# Altium schematic sheet Netconn.SchDoc
size 420 x 297 mm; Scale: 1:1; DocumentType: Схема электрическая принципиальная; FirstReferrence: АБВГ.123456.001
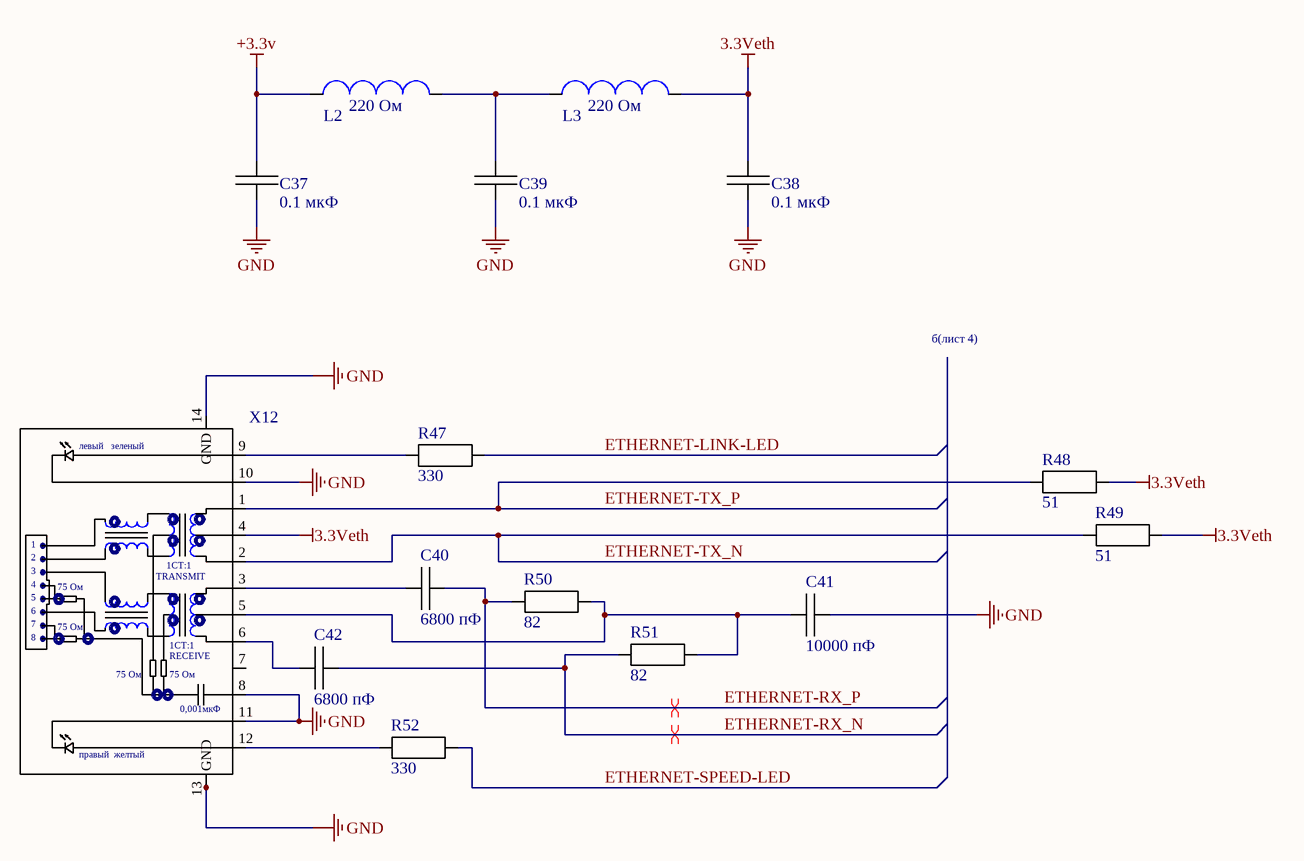
[diagram p0: Netconn.SchDoc]

## Parts
C37  0.1 мкФ  [К10-2,0х1,25х1,0]
C38  0.1 мкФ  [К10-2,0х1,25х1,0]
C39  0.1 мкФ  [К10-2,0х1,25х1,0]
C40  6800 пФ  [К10-2,0х1,25х1,0]
C41  10000 пФ  [К10-2,0х1,25х1,0]
C42  6800 пФ  [К10-2,0х1,25х1,0]
L2  220 Ом  [BLM21P_0805]
L3  220 Ом  [BLM21P_0805]
R47  330  [Р1-12-0,125]
R48  51  [Р1-12-0,125]
R49  51  [Р1-12-0,125]
R50  82  [Р1-12-0,125]
R51  82  [Р1-12-0,125]
R52  330  [Р1-12-0,125]
X12  (no value)  [HR911105]

## Nets
3.3Veth: C38.2 L3.2 R48.2 R49.2 X12.4
+3.3v: C37.2 L2.1
GND: C37.1 C38.1 C39.1 C41.2 X12.8 X12.10 X12.11 X12.13(GND) X12.14(GND)
ETHERNET-LINK-LED: R47.1
ETHERNET-RX_N: C42.2 R51.1
ETHERNET-RX_P: C40.2 R50.1
ETHERNET-SPEED-LED: R52.1
ETHERNET-TX_N: R49.1 X12.2
ETHERNET-TX_P: R48.1 X12.1
NetC39_2: C39.2 L2.2 L3.1
NetC40_1: C40.1 X12.3
NetC41_1: C41.1 R50.2 R51.2 X12.5
NetC42_1: C42.1 X12.6
NetR47_2: R47.2 X12.9
NetR52_2: R52.2 X12.12

Not connected (* = marked no-connect by the designer): X12 7

## Layout directives
differential pair: ETHERNET-RX_N, ETHERNET-RX_P

## Notes on the sheet
- б(лист 4)
- Перв. примен.
- Справ. №
- Подп. и дата
- Инв. № дубл.
- Взам. инв. №
- Разраб.
- Изм.
- Лист
- № докум.
- Подп.
- Дата
- Лит.
- Масса
- Масштаб
- Пров.
- Т.контр.
- Листов
- Инв. № подл.
- Утв.
- Н.контр.
- 2.106-A3
- Копировал
- Формат А3
- (in symbol HR911105A) левый   зеленый; 1СТ:1; TRANSMIT; 75 Ом; RECEIVE; 0,001мкФ; правый  желтый

## Library data of the parts
C37-C39 = 0805-X5R-2,2мкФ-10В-10%: Manufacturer: AVX; ManufacturerPartNumber: 0805ZD225KAT2A; TKE: X5R; Power/Voltage: 10 В; Tolerance: ±10%; Value: 2.2 мкФ; Category: Конденсатор; PartNumber: 0805ZD225KAT2A
C40-C42 = 0805-X5R-2,2мкФ-10В-10%: Manufacturer: AVX; ManufacturerPartNumber: 0805ZD225KAT2A; TKE: X5R; Power/Voltage: 10 В; Tolerance: ±10%; Category: Конденсатор; PartNumber: 0805ZD225KAT2A
  C40 C42: Value: 6800 пФ
  C41: Value: 10000 пФ
L2 L3 = BLM21PG221SH1: Manufacturer: Murata; PartNumber1: (220 Ом ±25% 2000мА); Power/Voltage: 2000мА; Tolerance: ±25%; Category: Катушка индуктивности; ManufacturerPartNumber: BLM21PG221SH1; Value: 220 Ом
R47-R52 = Р1-12-0,125-10,0 кОм±1%: PartNumber: АЛЯР.434110.005 ТУ; ManufacturerPartNumber: Р1-12-0,125-10,0 кОм±1%-Л; Tolerance: ±1%-Л; Power/Voltage: 0,125; Value: 10,0 кОм; Category: Резистор
X12 = HR911105A: Manufacturer: Pulse Electronics; PartNumber1: (100 Base-TX, RJ45 1x1, with LEDs, intergrated magnetics); Category: Соединители; ManufacturerPartNumber: HR911105A